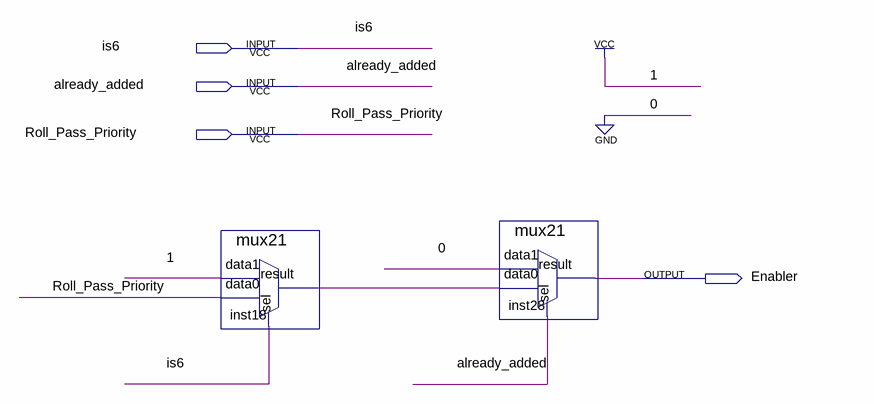
[diagram p0: schematic sheet]
// Quartus schematic can_only_add_once.bdf as structural Verilog: 2 symbols, 4 pins
module can_only_add_once (
  input  is6,
  input  already_added,
  input  Roll_Pass_Priority,
  output Enabler
);

  wire inst18_result;

  mux21 inst18 (.data1(1'b1), .data0(Roll_Pass_Priority), .sel(is6), .result(inst18_result));
  mux21 inst28 (.data1(1'b0), .data0(inst18_result), .sel(already_added), .result(Enabler));
endmodule
